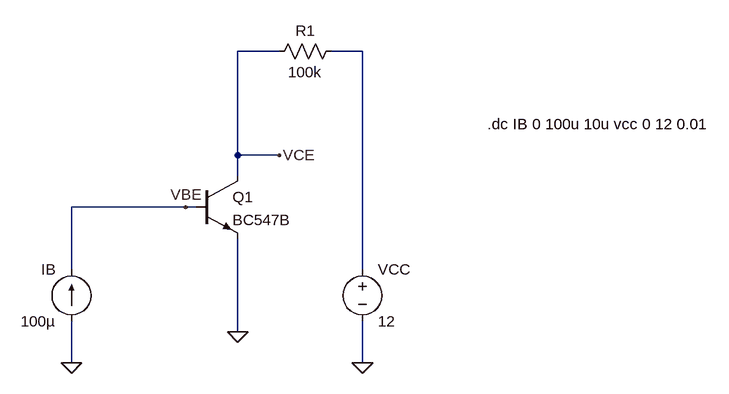
[diagram p0: schematic Draft1.asc]
Draft1.asc, the LTspice schematic file:
Version 4
SHEET 1 1148 680
WIRE 464 -48 400 -48
WIRE 592 -48 544 -48
WIRE 400 112 400 -48
WIRE 464 112 400 112
WIRE 400 144 400 112
WIRE 320 192 144 192
WIRE 336 192 320 192
WIRE 144 288 144 192
WIRE 592 288 592 -48
WIRE 400 384 400 240
WIRE 144 432 144 368
WIRE 592 432 592 368
FLAG 144 432 0
FLAG 400 384 0
FLAG 592 432 0
FLAG 320 192 VBE
FLAG 464 112 VCE
SYMBOL voltage 592 272 R0
SYMATTR InstName VCC
SYMATTR Value 12
SYMBOL current 144 368 R180
WINDOW 0 24 80 Left 2
WINDOW 3 24 0 Left 2
SYMATTR InstName IB
SYMATTR Value 100µ
SYMBOL npn 336 144 R0
SYMATTR InstName Q1
SYMATTR Value BC547B
SYMBOL res 560 -64 R90
WINDOW 0 0 56 VBottom 2
WINDOW 3 32 56 VTop 2
SYMATTR InstName R1
SYMATTR Value 100k
TEXT 784 64 Left 2 !.dc IB 0 100u 10u vcc 0 12 0.01

The netlist it stands for:
* Draft1.asc
VCC N001 0 12
IB 0 VBE 100µ
Q1 VCE VBE 0 0 BC547B
R1 N001 VCE 100k
.model NPN NPN
.model PNP PNP
.lib standard.bjt
.dc IB 0 100u 10u vcc 0 12 0.01
.backanno
.end